# Altium schematic sheet MainBoard_v1.SchDoc
size D
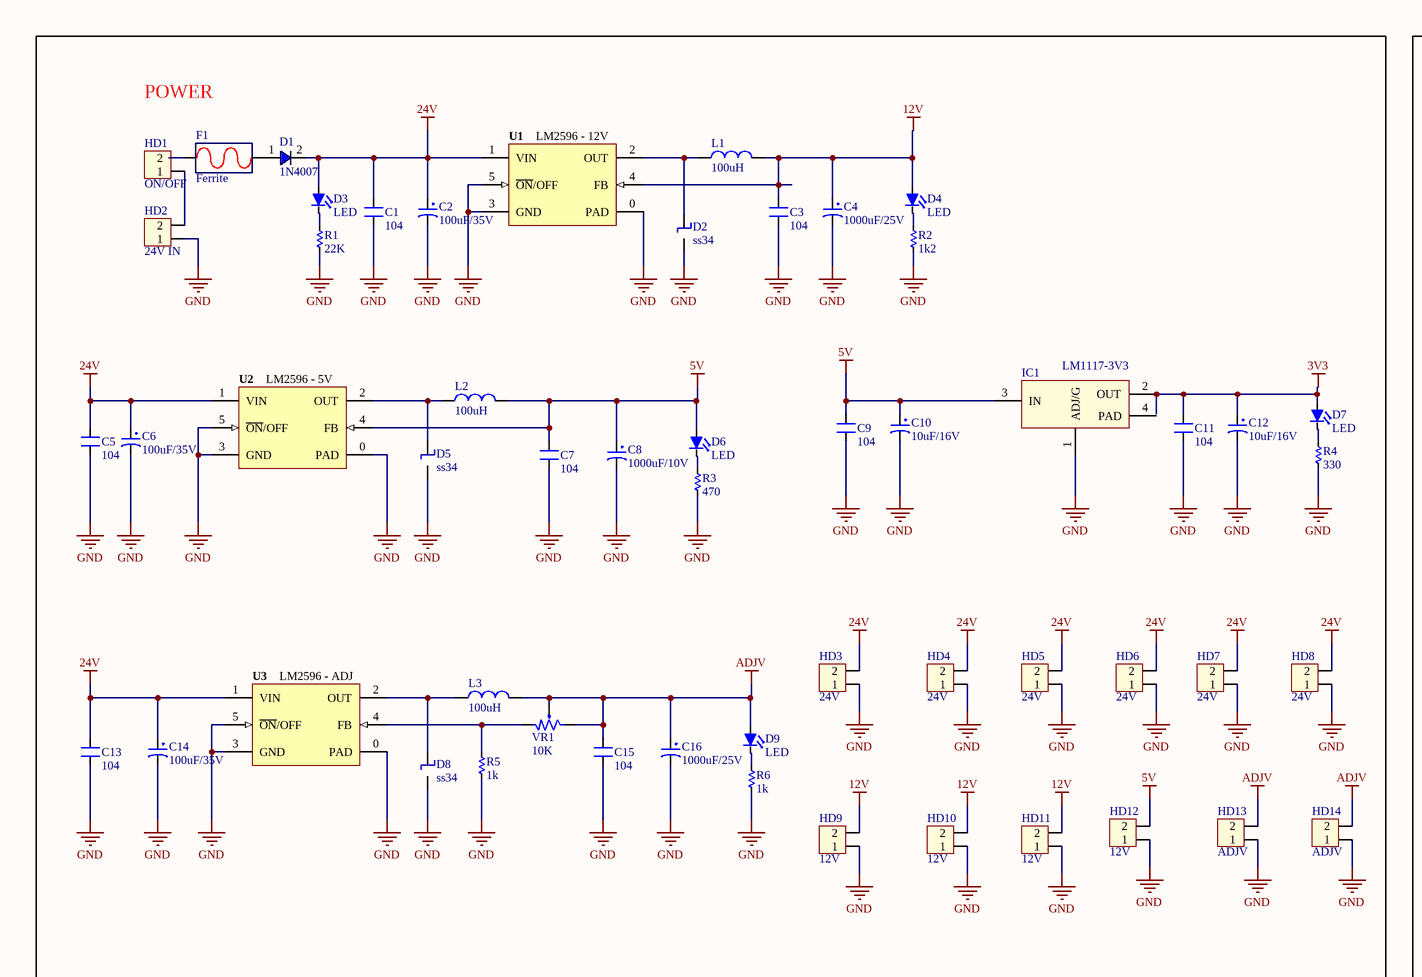
[diagram p0: MainBoard_v1.SchDoc, top left]
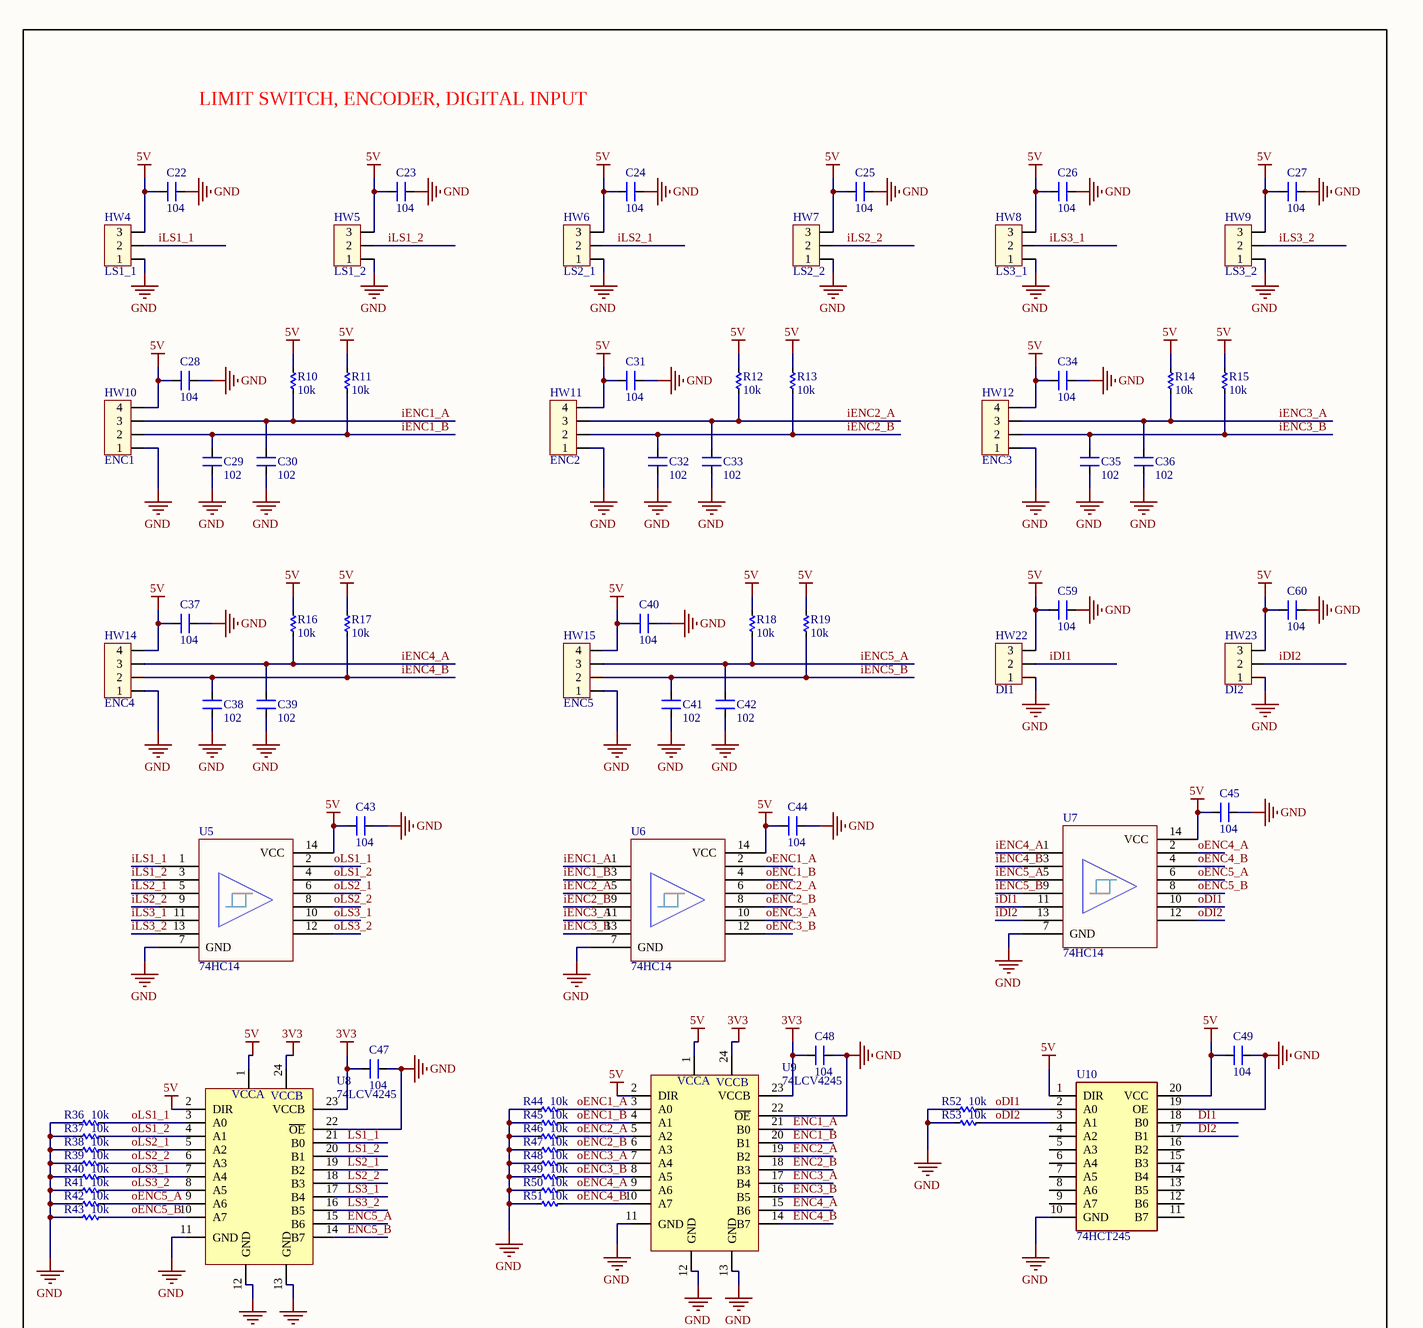
[diagram p1: MainBoard_v1.SchDoc, top right]
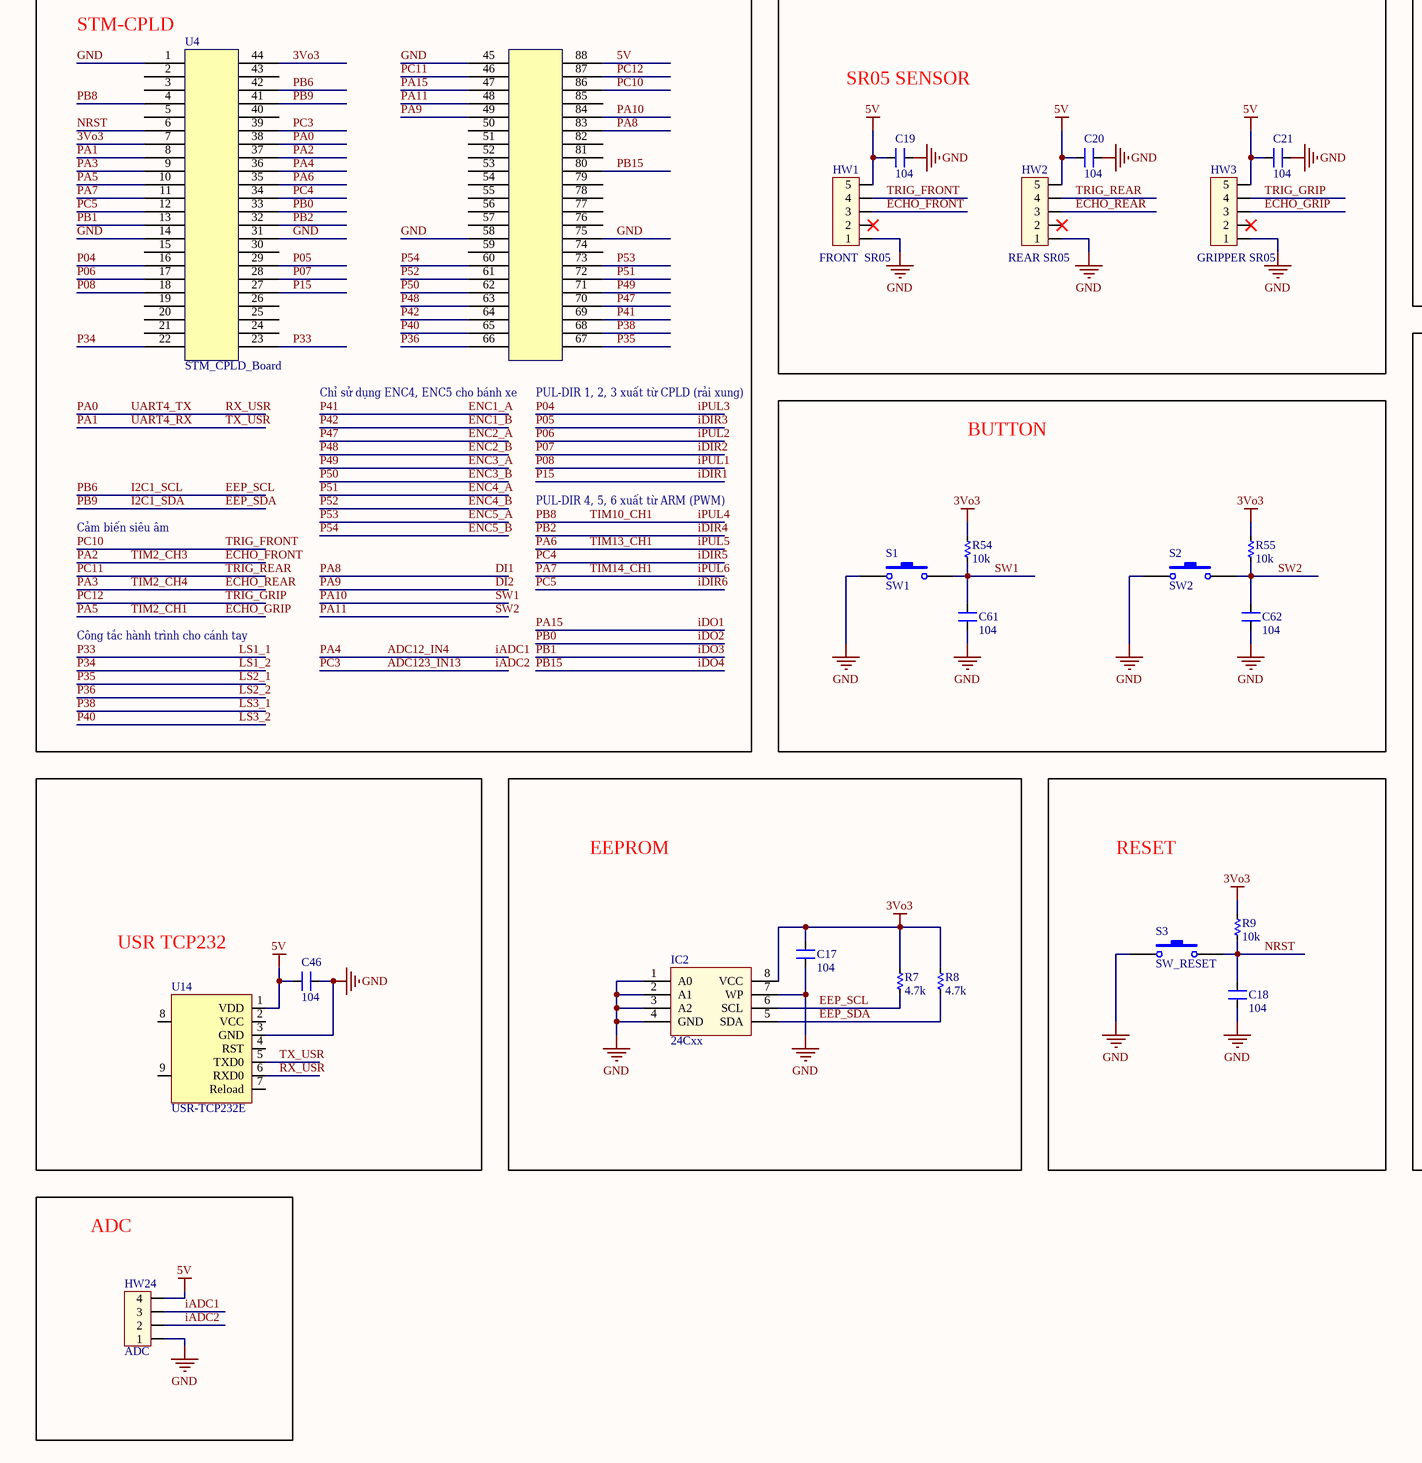
[diagram p2: MainBoard_v1.SchDoc, bottom left]
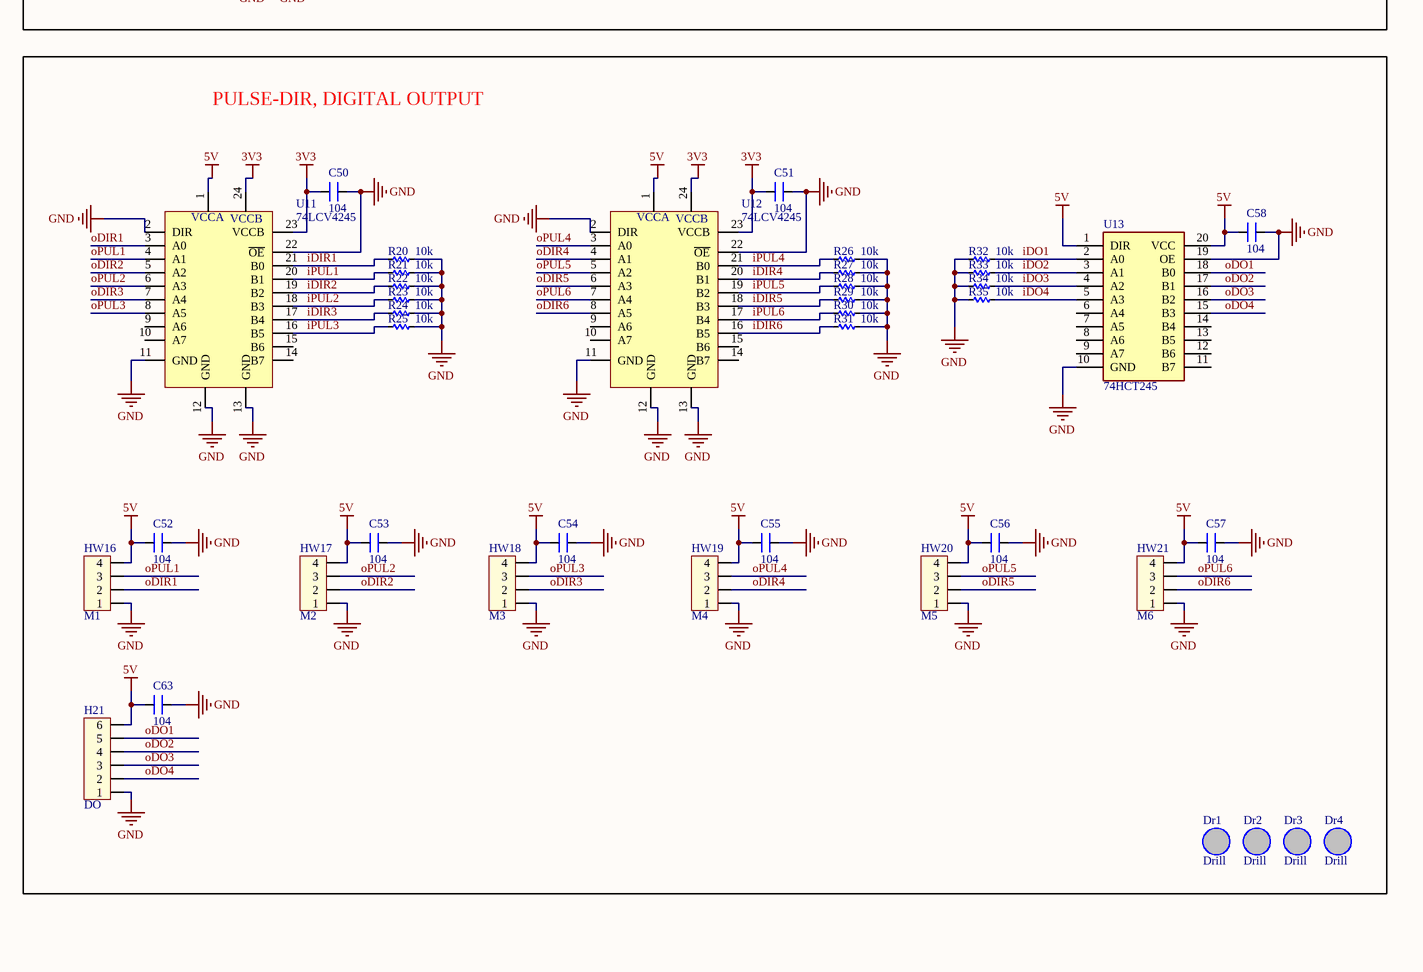
[diagram p3: MainBoard_v1.SchDoc, bottom right]

## Parts
C1  104  [CAP-SM-0805]
C2  100uF/35V  [Cap_Alu_D8]
C3  104  [CAP-SM-0805]
C4  1000uF/25V  [Cap_Alu_G]
C5  104  [CAP-SM-0805]
C6  100uF/35V  [Cap_Alu_D8]
C7  104  [CAP-SM-0805]
C8  1000uF/10V  [Cap_Alu_G]
C9  104  [CAP-SM-0805]
C10  10uF/16V  [Cap_Alu_B]
C11  104  [CAP-SM-0805]
C12  10uF/16V  [Cap_Alu_B]
C13  104  [CAP-SM-0805]
C14  100uF/35V  [Cap_Alu_D8]
C15  104  [CAP-SM-0805]
C16  1000uF/25V  [Cap_Alu_G]
C17  104  [CAP-SM-0805]
C18  104  [CAP-SM-0805]
C19  104  [CAP-SM-0805]
C20  104  [CAP-SM-0805]
C21  104  [CAP-SM-0805]
C22  104  [CAP-SM-0805]
C23  104  [CAP-SM-0805]
C24  104  [CAP-SM-0805]
C25  104  [CAP-SM-0805]
C26  104  [CAP-SM-0805]
C27  104  [CAP-SM-0805]
C28  104  [CAP-SM-0805]
C29  102  [CAP-SM-0805]
C30  102  [CAP-SM-0805]
C31  104  [CAP-SM-0805]
C32  102  [CAP-SM-0805]
C33  102  [CAP-SM-0805]
C34  104  [CAP-SM-0805]
C35  102  [CAP-SM-0805]
C36  102  [CAP-SM-0805]
C37  104  [CAP-SM-0805]
C38  102  [CAP-SM-0805]
C39  102  [CAP-SM-0805]
C40  104  [CAP-SM-0805]
C41  102  [CAP-SM-0805]
C42  102  [CAP-SM-0805]
C43  104  [CAP-SM-0805]
C44  104  [CAP-SM-0805]
C45  104  [CAP-SM-0805]
C46  104  [CAP-SM-0805]
C47  104  [CAP-SM-0805]
C48  104  [CAP-SM-0805]
C49  104  [CAP-SM-0805]
C50  104  [CAP-SM-0805]
C51  104  [CAP-SM-0805]
C52  104  [CAP-SM-0805]
C53  104  [CAP-SM-0805]
C54  104  [CAP-SM-0805]
C55  104  [CAP-SM-0805]
C56  104  [CAP-SM-0805]
C57  104  [CAP-SM-0805]
C58  104  [CAP-SM-0805]
C59  104  [CAP-SM-0805]
C60  104  [CAP-SM-0805]
C61  104  [CAP-SM-0805]
C62  104  [CAP-SM-0805]
C63  104  [CAP-SM-0805]
D1  1N4007  [DO-214AB]
D2  ss34  [DO-214AB]
D3  LED  [LED_0805_Blue]
D4  LED  [LED_0805_Blue]
D5  ss34  [DO-214AB]
D6  LED  [LED_0805_Blue]
D7  LED  [LED_0805_Blue]
D8  ss34  [DO-214AB]
D9  LED  [LED_0805_Blue]
Dr1  Drill  [Drill 3mm]
Dr2  Drill  [Drill 3mm]
Dr3  Drill  [Drill 3mm]
Dr4  Drill  [Drill 3mm]
F1  Ferrite  [Ferrite]
H21  DO  [Header White 6]
HD1  ON/OFF  [Domino 2]
HD2  24V IN  [Domino 2]
HD3  24V  [Domino 2]
HD4  24V  [Domino 2]
HD5  24V  [Domino 2]
HD6  24V  [Domino 2]
HD7  24V  [Domino 2]
HD8  24V  [Domino 2]
HD9  12V  [Domino 2]
HD10  12V  [Domino 2]
HD11  12V  [Domino 2]
HD12  12V  [Domino 2]
HD13  ADJV  [Domino 2]
HD14  ADJV  [Domino 2]
HW1  FRONT  SR05  [Header White 5]
HW2  REAR SR05  [Header White 5]
HW3  GRIPPER SR05  [Header White 5]
HW4  LS1_1  [Header White 3]
HW5  LS1_2  [Header White 3]
HW6  LS2_1  [Header White 3]
HW7  LS2_2  [Header White 3]
HW8  LS3_1  [Header White 3]
HW9  LS3_2  [Header White 3]
HW10  ENC1  [Header White 4]
HW11  ENC2  [Header White 4]
HW12  ENC3  [Header White 4]
HW14  ENC4  [Header White 4]
HW15  ENC5  [Header White 4]
HW16  M1  [Header White 4]
HW17  M2  [Header White 4]
HW18  M3  [Header White 4]
HW19  M4  [Header White 4]
HW20  M5  [Header White 4]
HW21  M6  [Header White 4]
HW22  DI1  [Header White 3]
HW23  DI2  [Header White 3]
HW24  ADC  [Header White 4]
IC1  LM1117-3V3  [SOT223-4N]
IC2  24Cxx  [SOIC8]
L1  100uH  [INDUCTOR_SMD]
L2  100uH  [INDUCTOR_SMD]
L3  100uH  [INDUCTOR_SMD]
R1  22K  [RES-SM-0805]
R2  1k2  [RES-SM-0805]
R3  470  [RES-SM-0805]
R4  330  [RES-SM-0805]
R5  1k  [RES-SM-0805]
R6  1k  [RES-SM-0805]
R7  4.7k  [RES-SM-0805]
R8  4.7k  [RES-SM-0805]
R9  10k  [RES-SM-0805]
R10  10k  [RES-SM-0805]
R11  10k  [RES-SM-0805]
R12  10k  [RES-SM-0805]
R13  10k  [RES-SM-0805]
R14  10k  [RES-SM-0805]
R15  10k  [RES-SM-0805]
R16  10k  [RES-SM-0805]
R17  10k  [RES-SM-0805]
R18  10k  [RES-SM-0805]
R19  10k  [RES-SM-0805]
R20  10k  [RES-SM-0805]
R21  10k  [RES-SM-0805]
R22  10k  [RES-SM-0805]
R23  10k  [RES-SM-0805]
R24  10k  [RES-SM-0805]
R25  10k  [RES-SM-0805]
R26  10k  [RES-SM-0805]
R27  10k  [RES-SM-0805]
R28  10k  [RES-SM-0805]
R29  10k  [RES-SM-0805]
R30  10k  [RES-SM-0805]
R31  10k  [RES-SM-0805]
R32  10k  [RES-SM-0805]
R33  10k  [RES-SM-0805]
R34  10k  [RES-SM-0805]
R35  10k  [RES-SM-0805]
R36  10k  [RES-SM-0805]
R37  10k  [RES-SM-0805]
R38  10k  [RES-SM-0805]
R39  10k  [RES-SM-0805]
R40  10k  [RES-SM-0805]
R41  10k  [RES-SM-0805]
R42  10k  [RES-SM-0805]
R43  10k  [RES-SM-0805]
R44  10k  [RES-SM-0805]
R45  10k  [RES-SM-0805]
R46  10k  [RES-SM-0805]
R47  10k  [RES-SM-0805]
R48  10k  [RES-SM-0805]
R49  10k  [RES-SM-0805]
R50  10k  [RES-SM-0805]
R51  10k  [RES-SM-0805]
R52  10k  [RES-SM-0805]
R53  10k  [RES-SM-0805]
R54  10k  [RES-SM-0805]
R55  10k  [RES-SM-0805]
S1  SW1  [SW2]
S2  SW2  [SW2]
S3  SW_RESET  [SW2]
U1  LM2596 - 12V  [TO263]
U2  LM2596 - 5V  [TO263]
U3  LM2596 - ADJ  [TO263]
U4  STM_CPLD_Board  [STM_CPLD_Board]
U5  74HC14  [SOIC14]
U6  74HC14  [SOIC14]
U7  74HC14  [SOIC14]
U8  74LCV4245  [SOIC24 - wide]
U9  74LCV4245  [SOIC24 - wide]
U10  74HCT245  [soic20]
U11  74LCV4245  [SOIC24 - wide]
U12  74LCV4245  [SOIC24 - wide]
U13  74HCT245  [soic20]
U14  USR-TCP232E  [USR-TCP232E]
VR1  10K  [VR1]

## Blocks framed on the sheet
POWER: C1-C16 D1-D9 F1 HD1-HD14 IC1 L1-L3 R1-R6 U1-U3 VR1
LIMIT SWITCH, ENCODER, DIGITAL INPUT: C22-C45 C47-C49 C59 C60 HW4-HW12 HW14 HW15 HW22 HW23 R10-R19 R36-R53 U5-U10
STM-CPLD: U4
SR05 SENSOR: C19-C21 HW1-HW3
PULSE-DIR, DIGITAL OUTPUT: C50-C58 C63 Dr1-Dr4 H21 HW16-HW21 R20-R35 U11-U13
BUTTON: C61 C62 R54 R55 S1 S2
USR TCP232: C46 U14
EEPROM: C17 IC2 R7 R8
RESET: C18 R9 S3
ADC: HW24

## Nets
3V3: C11.2 C12.1 C47.1 C48.1 C50.1 C51.1 D7.1(A) IC1.2(OUT) U8.23(VCCB) U8.24(VCC(B)) U9.23(VCCB) U9.24(VCC(B)) U11.23(VCCB) U11.24(VCC(B)) U12.23(VCCB) U12.24(VCC(B))
3Vo3: C17.2 IC2.8(VCC) R7.1 R8.1 R9.1 R54.1 R55.1 U4.7 U4.44
5V: C7.2 C8.1 C9.2 C10.1 C19.1 C20.1 C21.1 C22.1 C23.1 C24.1 C25.1 C26.1 C27.1 C28.1 C31.1 C34.1 C37.1 C40.1 C43.1 C44.1 C45.1 C46.1 C49.1 C52.1 C53.1 C54.1 C55.1 C56.1 C57.1 C58.1 C59.1 C60.1 C63.1 D6.1(A) H21.6 HD12.2 HW1.5 HW2.5 HW3.5 HW4.3 HW5.3 HW6.3 HW7.3 HW8.3 HW9.3 HW10.4 HW11.4 HW12.4 HW14.4 HW15.4 HW16.4 HW17.4 HW18.4 HW19.4 HW20.4 HW21.4 HW22.3 HW23.3 HW24.4 IC1.3(IN) L2.2 R10.1 R11.1 R12.1 R13.1 R14.1 R15.1 R16.1 R17.1 R18.1 R19.1 U2.4(FB) U4.88 U5.14(VCC) U6.14(VCC) U7.14(VCC) U8.1(VCC(A)) U8.2(DIR) U9.1(VCC(A)) U9.2(DIR) U10.1(DIR) U10.20(VCC) U11.1(VCC(A)) U12.1(VCC(A)) U13.1(DIR) U13.20(VCC) U14.1(VDD)
12V: C3.2 C4.1 D4.1(A) HD9.2 HD10.2 HD11.2 L1.2 U1.4(FB)
24V: C1.2 C2.1 C5.2 C6.1 C13.2 C14.1 D1.2 D3.1(A) HD3.2 HD4.2 HD5.2 HD6.2 HD7.2 HD8.2 U1.1(VIN) U2.1(VIN) U3.1(VIN)
ADJV: C15.2 C16.1 D9.1(A) HD13.2 HD14.2 L3.2 VR1.2 VR1.3
GND: C1.1 C2.2 C3.1 C4.2 C5.1 C6.2 C7.1 C8.2 C9.1 C10.2 C11.1 C12.2 C13.1 C14.2 C15.1 C16.2 C17.1 C18.1 C19.2 C20.2 C21.2 C22.2 C23.2 C24.2 C25.2 C26.2 C27.2 C28.2 C29.1 C30.1 C31.2 C32.1 C33.1 C34.2 C35.1 C36.1 C37.2 C38.1 C39.1 C40.2 C41.1 C42.1 C43.2 C44.2 C45.2 C46.2 C47.2 C48.2 C49.2 C50.2 C51.2 C52.2 C53.2 C54.2 C55.2 C56.2 C57.2 C58.2 C59.2 C60.2 C61.1 C62.1 C63.2 D2.2(B) D5.2(B) D8.2(B) H21.1 HD2.1 HD3.1 HD4.1 HD5.1 HD6.1 HD7.1 HD8.1 HD9.1 HD10.1 HD11.1 HD12.1 HD13.1 HD14.1 HW1.1 HW2.1 HW3.1 HW4.1 HW5.1 HW6.1 HW7.1 HW8.1 HW9.1 HW10.1 HW11.1 HW12.1 HW14.1 HW15.1 HW16.1 HW17.1 HW18.1 HW19.1 HW20.1 HW21.1 HW22.1 HW23.1 HW24.1 IC1.1(ADJ/G) IC2.1(A0) IC2.2(A1) IC2.3(A2) IC2.4(GND) IC2.7(WP) R1.2 R2.2 R3.2 R4.2 R5.2 R6.2 R20.1 R21.1 R22.1 R23.1 R24.1 R25.1 R26.1 R27.1 R28.1 R29.1 R30.1 R31.1 R32.2 R33.2 R34.2 R35.2 R36.2 R37.2 R38.2 R39.2 R40.2 R41.2 R42.2 R43.2 R44.2 R45.2 R46.2 R47.2 R48.2 R49.2 R50.2 R51.2 R52.2 R53.2 S1.1 S2.1 S3.1 U1.0(PAD) U1.3(GND) U1.5(~{ON}/OFF) U2.0(PAD) U2.3(GND) U2.5(~{ON}/OFF) U3.0(PAD) U3.3(GND) U3.5(~{ON}/OFF) U4.1 U4.14 U4.31 U4.45 U4.58 U4.75 U5.7(GND) U6.7(GND) U7.7(GND) U8.11(GND) U8.12(GND) U8.13(GND) U8.22(~{OE}) U9.11(GND) U9.12(GND) U9.13(GND) U9.22(~{OE}) U10.10(GND) U10.19(OE) U11.2(DIR) U11.11(GND) U11.12(GND) U11.13(GND) U11.22(~{OE}) U12.2(DIR) U12.11(GND) U12.12(GND) U12.13(GND) U12.22(~{OE}) U13.10(GND) U13.19(OE) U14.3(GND)
ADC12_IN4: HW24.3 U4.36  [also labelled iADC1, PA4]
ADC123_IN13: HW24.2 U4.39  [also labelled iADC2, PC3]
DI1: U4.83 U10.18(B0)  [also labelled PA8]
DI2: U4.49 U10.17(B1)  [also labelled PA9]
ECHO_FRONT: HW1.3 U4.37  [also labelled PA2, TIM2_CH3]
ECHO_GRIP: HW3.3 U4.10  [also labelled PA5, TIM2_CH1]
ECHO_REAR: HW2.3 U4.9  [also labelled PA3, TIM2_CH4]
EEP_SCL: IC2.6(SCL) R7.2 U4.42  [also labelled I2C1_SCL, PB6]
EEP_SDA: IC2.5(SDA) R8.2 U4.41  [also labelled I2C1_SDA, PB9]
ENC1_A: U4.69 U9.21(B0)  [also labelled P41]
ENC1_B: U4.64 U9.20(B1)  [also labelled P42]
ENC2_A: U4.70 U9.19(B2)  [also labelled P47]
ENC2_B: U4.63 U9.18(B3)  [also labelled P48]
ENC3_A: U4.71 U9.17(B4)  [also labelled P49]
ENC3_B: U4.62 U9.16(B5)  [also labelled P50]
ENC4_A: U4.72 U9.15(B6)  [also labelled P51]
ENC4_B: U4.61 U9.14(B7)  [also labelled P52]
ENC5_A: U4.73 U8.15(B6)  [also labelled P53]
ENC5_B: U4.60 U8.14(B7)  [also labelled P54]
iDI1: HW22.2 U7.11
iDI2: HW23.2 U7.13
iDIR1: R20.2 U4.27 U11.21(B0)  [also labelled P15]
iDIR2: R22.2 U4.28 U11.19(B2)  [also labelled P07]
iDIR3: R24.2 U4.29 U11.17(B4)  [also labelled P05]
iDIR4: R27.2 U4.32 U12.20(B1)  [also labelled PB2]
iDIR5: R29.2 U4.34 U12.18(B3)  [also labelled PC4]
iDIR6: R31.2 U4.12 U12.16(B5)  [also labelled PC5]
iDO1: R32.1 U4.47 U13.2(A0)  [also labelled PA15]
iDO2: R33.1 U4.33 U13.3(A1)  [also labelled PB0]
iDO3: R34.1 U4.13 U13.4(A2)  [also labelled PB1]
iDO4: R35.1 U4.80 U13.5(A3)  [also labelled PB15]
iENC1_A: C30.2 HW10.3 R10.2 U6.1
iENC1_B: C29.2 HW10.2 R11.2 U6.3
iENC2_A: C33.2 HW11.3 R12.2 U6.5
iENC2_B: C32.2 HW11.2 R13.2 U6.9
iENC3_A: C36.2 HW12.3 R14.2 U6.11
iENC3_B: C35.2 HW12.2 R15.2 U6.13
iENC4_A: C39.2 HW14.3 R16.2 U7.1
iENC4_B: C38.2 HW14.2 R17.2 U7.3
iENC5_A: C42.2 HW15.3 R18.2 U7.5
iENC5_B: C41.2 HW15.2 R19.2 U7.9
iLS1_1: HW4.2 U5.1
iLS1_2: HW5.2 U5.3
iLS2_1: HW6.2 U5.5
iLS2_2: HW7.2 U5.9
iLS3_1: HW8.2 U5.11
iLS3_2: HW9.2 U5.13
iPUL1: R21.2 U4.18 U11.20(B1)  [also labelled P08]
iPUL2: R23.2 U4.17 U11.18(B3)  [also labelled P06]
iPUL3: R25.2 U4.16 U11.16(B5)  [also labelled P04]
iPUL4: R26.2 U4.4 U12.21(B0)  [also labelled PB8, TIM10_CH1]
iPUL5: R28.2 U4.35 U12.19(B2)  [also labelled PA6, TIM13_CH1]
iPUL6: R30.2 U4.11 U12.17(B4)  [also labelled PA7, TIM14_CH1]
LS1_1: U4.23 U8.21(B0)  [also labelled P33]
LS1_2: U4.22 U8.20(B1)  [also labelled P34]
LS2_1: U4.67 U8.19(B2)  [also labelled P35]
LS2_2: U4.66 U8.18(B3)  [also labelled P36]
LS3_1: U4.68 U8.17(B4)  [also labelled P38]
LS3_2: U4.65 U8.16(B5)  [also labelled P40]
NRST: C18.2 R9.2 S3.2 U4.6
oDI1: R52.1 U7.10 U10.2(A0)
oDI2: R53.1 U7.12 U10.3(A1)
oDIR1: HW16.2 U11.3(A0)
oDIR2: HW17.2 U11.5(A2)
oDIR3: HW18.2 U11.7(A4)
oDIR4: HW19.2 U12.4(A1)
oDIR5: HW20.2 U12.6(A3)
oDIR6: HW21.2 U12.8(A5)
oDO1: H21.5 U13.18(B0)
oDO2: H21.4 U13.17(B1)
oDO3: H21.3 U13.16(B2)
oDO4: H21.2 U13.15(B3)
oENC1_A: R44.1 U6.2 U9.3(A0)
oENC1_B: R45.1 U6.4 U9.4(A1)
oENC2_A: R46.1 U6.6 U9.5(A2)
oENC2_B: R47.1 U6.8 U9.6(A3)
oENC3_A: R48.1 U6.10 U9.7(A4)
oENC3_B: R49.1 U6.12 U9.8(A5)
oENC4_A: R50.1 U7.2 U9.9(A6)
oENC4_B: R51.1 U7.4 U9.10(A7)
oENC5_A: R42.1 U7.6 U8.9(A6)
oENC5_B: R43.1 U7.8 U8.10(A7)
oLS1_1: R36.1 U5.2 U8.3(A0)
oLS1_2: R37.1 U5.4 U8.4(A1)
oLS2_1: R38.1 U5.6 U8.5(A2)
oLS2_2: R39.1 U5.8 U8.6(A3)
oLS3_1: R40.1 U5.10 U8.7(A4)
oLS3_2: R41.1 U5.12 U8.8(A5)
oPUL1: HW16.3 U11.4(A1)
oPUL2: HW17.3 U11.6(A3)
oPUL3: HW18.3 U11.8(A5)
oPUL4: HW19.3 U12.3(A0)
oPUL5: HW20.3 U12.5(A2)
oPUL6: HW21.3 U12.7(A4)
PA0: U4.38 U14.6(RXD0)  [also labelled RX_USR, UART4_TX]
PA1: U4.8 U14.5(TXD0)  [also labelled TX_USR, UART4_RX]
PA10: C61.2 R54.2 S1.2 U4.84  [also labelled SW1]
PA11: C62.2 R55.2 S2.2 U4.48  [also labelled SW2]
PC10: HW1.4 U4.86  [also labelled TRIG_FRONT]
PC11: HW2.4 U4.46  [also labelled TRIG_REAR]
PC12: HW3.4 U4.87  [also labelled TRIG_GRIP]
NetD2_1: D2.1(a) L1.1 U1.2(OUT)
NetD3_2: D3.2(K) R1.1
NetD4_2: D4.2(K) R2.1
NetD5_1: D5.1(a) L2.1 U2.2(OUT)
NetD6_2: D6.2(K) R3.1
NetD7_2: D7.2(K) R4.1
NetD8_1: D8.1(a) L3.1 U3.2(OUT)
NetD9_2: D9.2(K) R6.1
NetF1_1: F1.1 HD1.2
NetHD1_1: HD1.1 HD2.2
NetR5_1: R5.1 U3.4(FB) VR1.1

Not connected (* = marked no-connect by the designer): D1 1; F1 2; HW1 2*; HW2 2*; HW3 2*; IC1 4(PAD); U4 2 3 5 15 19 20 21 24 25 26 30 40 43 50 51 52 53 54 55 56 57 59 74 76 77 78 79 81 82 85; U10 4(A2) 5(A3) 6(A4) 7(A5) 8(A6) 9(A7) 11(B7) 12(B6) 13(B5) 14(B4) 15(B3) 16(B2); U11 9(A6) 10(A7) 14(B7) 15(B6); U12 9(A6) 10(A7) 14(B7) 15(B6); U13 6(A4) 7(A5) 8(A6) 9(A7) 11(B7) 12(B6) 13(B5) 14(B4); U14 2(VCC) 4(RST) 7(Reload) 8 9

## Notes on the sheet
- (near U4) Chỉ sử dụng ENC4, ENC5 cho bánh xe
- (near U4) PUL-DIR 1, 2, 3 xuất từ CPLD (rải xung)
- Cảm biến siêu âm
- PUL-DIR 4, 5, 6 xuất từ ARM (PWM)
- Công tắc hành trình cho cánh tay
- (in symbol 74LCV4245) VCCA

## Library data of the parts
C1 C3 C5 C7 C9 C11 C13 C15 C17-C63 = CAP_SM_0805: Ceramic Capacitor SMD
C2 C4 C6 C8 C10 C12 C14 C16 = Cap_SM_Alu: SMD Aluminum Electrolytic Capacitor; Size D8: 100uF/35V, 220uF/16V, 330uF/6.3V; Size A: 2.2uF/35V, 3.3uF/35V, 4.7uF/25V; Size D: 47uF/25V, 100uF/16V,; Size C: 33uF/16V; Size B: 1uF/50V, 10uF/16V, 22uF/16V; Size F: 470uF/16V; Size G: 330uF/35V, 680uF/16V, 1000uF/10V
D1 = Diode: General Rectifier; Link: http://www.tme.vn/Product.aspx?id=769#page=pro_info
D2 D5 D8 = ss34: Surface Mount Schottky Barrier Rectifier
D3 D4 D6 D7 D9 = LED_SMD: LED SMD
Dr1-Dr4 = Drill 3mm
F1 = Ferrite bead
H21 = Header white 6: Value: Header white 6
HD1-HD14 = Domino 2: Domino 2 200mil; Value: Domino 2
HW1-HW3 = Header white 5: Value: Header white 5
HW4-HW9 HW22 HW23 = Header white 3: Connector 3; Value: Connector 3
HW10-HW12 HW14-HW21 HW24 = Header white 4: Value: Header white 4
IC1 = LM1117: Available in 1.8V, 2.5V, 2.85V, 3.3V, 5V, and  Adjustable Versions; Value: LM317
IC2 = 24Cxx: Standard 2-Wire Bus Interface Serial EEPROM; Value: DIP 8; Value: 24Cxx; Copyright by: VanDungEvn
L1-L3 = L1: Inductor; Value: 150 mH
R1-R55 = Res-SMD: Resistor; Manufacturer: Generic Components; Class: Passive; Published: 08/06/2000; Publisher: Altium Hobart Technology Centre
S1-S3 = SW - 2Pin: Switch button 2 pin
U1 = LM2596: SIMPLE SWITCHER® Power Converter 150-kHz - 3A Step-Down Voltage Regulator; Max Output Current: 3 (6.0 peak) A; Max Output Voltage: mV; Category: IC-Power; Max Input Voltage: 12 V; Min Input Voltage: mV; Min Output Voltage: mV; Mounting Technology: Surface Mount; Status: Unreleased; Supply Voltage: mV; Temperature Range: -40 to +125 degC
U2 U3 = LM2596: SIMPLE SWITCHER® Power Converter 150-kHz - 3A Step-Down Voltage Regulator; Max Input Voltage: 12 V; Max Output Current: 3 (6.0 peak) A; Max Output Voltage: mV; Category: IC-Power; Min Input Voltage: mV; Min Output Voltage: mV; Mounting Technology: Surface Mount; Status: Unreleased; Supply Voltage: mV; Temperature Range: -40 to +125 degC
U4 = STM_CPLD_Board: STM32f4 and Max2 570 on one board
U5-U7 = 74HC14: Hex Inverters With SCHMITT-TRIGGER Inputs
U8 U9 U11 U12 = 74LCV4245: Octal dual supply translating transceiver; 3-state
U10 U13 = 74HC245: Octal bus tranceiver; Link: http://tme.vn/Product.aspx?id=1404#page=pro_info
U14 = Component_1
VR1 = VR1: Var Resistor; Value: VR 10K